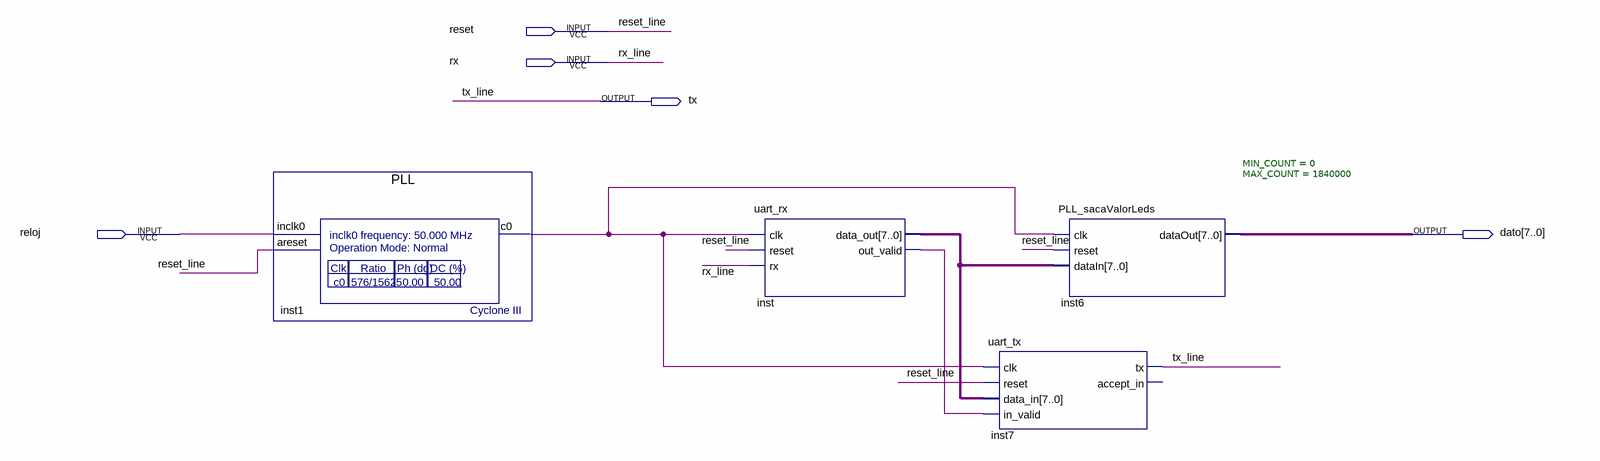
[diagram p0: schematic sheet]
// Quartus schematic BloquesPruebaControl.bdf as structural Verilog: 4 symbols, 5 pins
module BloquesPruebaControl (
  input  reset,
  input  rx,
  input  reloj,
  output tx,
  output [7:0] dato
);

  wire inst1_c0, inst_out_valid;
  wire [7:0] inst_data_out;

  PLL inst1 (.inclk0(reloj), .areset(reset), .c0(inst1_c0));
  uart_rx inst (.clk(inst1_c0), .reset(reset), .rx(rx), .data_out(inst_data_out), .out_valid(inst_out_valid));
  uart_tx inst7 (
    .clk(inst1_c0), .reset(reset), .data_in(inst_data_out), .in_valid(inst_out_valid), .tx(tx));  // open: accept_in
  PLL_sacaValorLeds #(.MIN_COUNT(0), .MAX_COUNT(1840000)) inst6 (
    .clk(inst1_c0), .reset(reset), .dataIn(inst_data_out), .dataOut(dato));

  // Other names for the same wires on the sheet: reset_line = reset; rx_line = rx; tx_line = tx
endmodule
